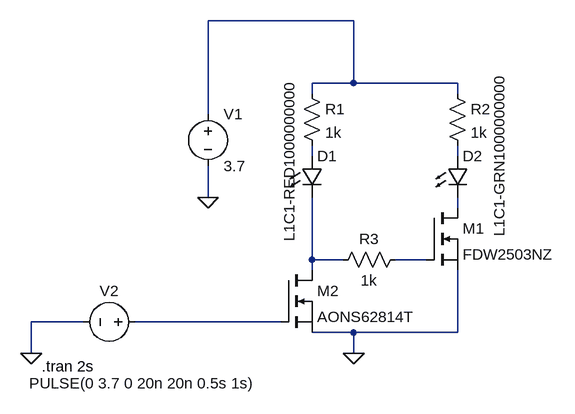
[diagram p0: schematic Battery Status LEDs.asc]
Battery Status LEDs.asc, the LTspice schematic file:
Version 4
SHEET 1 880 680
WIRE 256 -112 32 -112
WIRE 256 -16 256 -112
WIRE 256 -16 192 -16
WIRE 416 -16 256 -16
WIRE 192 0 192 -16
WIRE 416 0 416 -16
WIRE 32 32 32 -112
WIRE 192 96 192 80
WIRE 416 96 416 80
WIRE 32 160 32 112
WIRE 416 176 416 160
WIRE 192 256 192 160
WIRE 240 256 192 256
WIRE 368 256 320 256
WIRE 192 272 192 256
WIRE -160 352 -240 352
WIRE 144 352 -80 352
WIRE 256 368 192 368
WIRE 416 368 416 272
WIRE 416 368 256 368
WIRE -240 400 -240 352
WIRE 256 400 256 368
FLAG -240 400 0
FLAG 256 400 0
FLAG 32 160 0
SYMBOL LED 176 96 R0
WINDOW 3 -19 -119 VRight 2
SYMATTR InstName D1
SYMATTR Value L1C1-RED1000000000
SYMBOL LED 400 96 R0
WINDOW 3 80 -130 VRight 2
SYMATTR InstName D2
SYMATTR Value L1C1-GRN1000000000
SYMBOL res 176 -16 R0
SYMATTR InstName R1
SYMATTR Value 1k
SYMBOL res 400 -16 R0
SYMATTR InstName R2
SYMATTR Value 1k
SYMBOL voltage 32 16 R0
WINDOW 123 0 0 Left 0
WINDOW 39 0 0 Left 0
SYMATTR InstName V1
SYMATTR Value 3.7
SYMBOL voltage -64 352 R90
WINDOW 0 -32 56 VBottom 2
WINDOW 3 79 5 VTop 2
WINDOW 123 0 0 Left 0
WINDOW 39 0 0 Left 0
SYMATTR InstName V2
SYMATTR Value PULSE(0 3.7 0 20n 20n 0.5s 1s)
SYMBOL nmos 144 272 R0
SYMATTR InstName M2
SYMATTR Value AONS62814T
SYMBOL res 336 240 R90
WINDOW 0 0 56 VBottom 2
WINDOW 3 32 56 VTop 2
SYMATTR InstName R3
SYMATTR Value 1k
SYMBOL nmos 368 176 R0
SYMATTR InstName M1
SYMATTR Value FDW2503NZ
TEXT -224 420 Left 2 !.tran 2s

The netlist it stands for:
* Battery Status LEDs.asc
D1 N002 N005 L1C1-RED1000000000
D2 N003 N004 L1C1-GRN1000000000
R1 N001 N002 1k
R2 N001 N003 1k
V1 N001 0 3.7
V2 N007 0 PULSE(0 3.7 0 20n 20n 0.5s 1s)
M2 N005 N007 0 0 AONS62814T
R3 N006 N005 1k
M1 N004 N006 0 0 FDW2503NZ
.model D D
.lib standard.dio
.model NMOS NMOS
.model PMOS PMOS
.lib standard.mos
.tran 2s
.backanno
.end